# EAGLE design FFPTD (EAGLE 9.6.2)
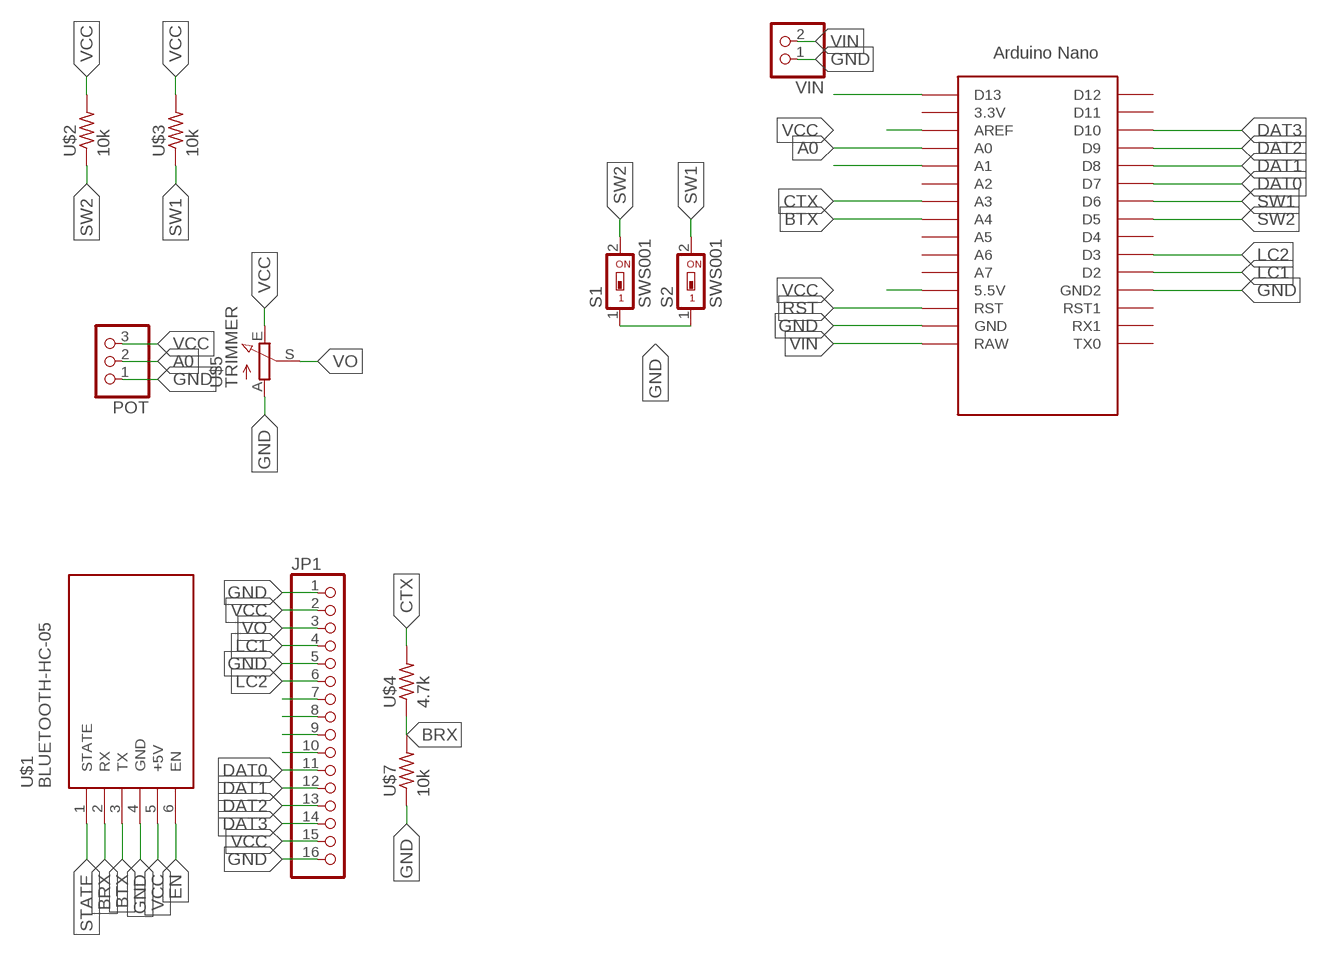
[diagram p0: schematic, sheet 1]

## Parts
JP1  PINHD-1X16  [1X16]
POT  PINHD-1X3  [1X03]
S1  SWS001  [SMS-001]
S2  SWS001  [SMS-001]
U$1  BLUETOOTH-HC-05  [WIRELESS-BLUETOOTH-HC-05]
U$2  10k  RES-7  [0204/7]
U$3  10k  RES-7  [0204/7]
U$4  4.7k  RES-7  [0204/7]
U$5  TRIMMER  [RJ9W]
U$6  ARDUINO_NANO  [NANO]
U$7  10k  RES-7  [0204/7]
VIN  PINHD-1X2  [1X02]

## Nets
A0: POT.2 U$6.A0
BRX: U$1.2(RX) U$4.1 U$7.2
BTX: U$1.3(TX) U$6.A4
CTX: U$4.2 U$6.A3
DAT0: JP1.11 U$6.D7
DAT1: JP1.12 U$6.D8
DAT2: JP1.13 U$6.D9
DAT3: JP1.14 U$6.D10
EN: U$1.6(EN)
GND: JP1.1 JP1.5 JP1.16 POT.1 S1.1 S2.1 U$1.4(GND) U$5.A U$6.GND U$6.GND1(GND2) U$7.1 VIN.1
LC1: JP1.4 U$6.D2
LC2: JP1.6 U$6.D3
N$31: U$6.A1
N$33: JP1.7
N$34: JP1.8
N$35: JP1.9
N$36: JP1.10
N$37: U$6.D13
RST: U$6.RST
STATE: U$1.1(STATE)
SW1: S2.2 U$3.1 U$6.D6
SW2: S1.2 U$2.1 U$6.D5
VCC: JP1.2 JP1.15 POT.3 U$1.5(+5V) U$2.2 U$3.2 U$5.E U$6.5V(5.5V) U$6.AREF
VIN: U$6.RAW VIN.2
VO: JP1.3 U$5.S
Unconnected: U$6.3.3V U$6.A2 U$6.A5 U$6.A6 U$6.A7 U$6.D4 U$6.D11 U$6.D12 U$6.RST1 U$6.RX1 U$6.TX0

## Library data of the parts
JP1 = pinhead:PINHD-1X16: PIN HEADER
POT = MIA_LIBRARY-2-2-2:PINHD-1X3: PIN HEADER
S1 S2 = smd-special:SWS001: SMD Dip Switch 1 pol.
U$1 = MIA_LIBRARY-2-2-2:BLUETOOTH-HC-05: Bluetooth Transceiver Module based on HC-05 board Tutorial is available here: https://arduino-info.wikispaces.com/BlueTooth-HC05-HC06-Modules-How-To Click here to find device on ebay.com <http://www.ebay.com/sch/hc-05+module+rs232>
U$2-U$4 U$7 = MIA_LIBRARY-2-2-2:RES-7
U$5 = MIA_LIBRARY-2-2-2:TRIMMER
U$6 = MIA_LIBRARY-2-2-2:ARDUINO_NANO: Arduino Nano
VIN = MIA_LIBRARY-2-2-2:PINHD-1X2: PIN HEADER

## Board
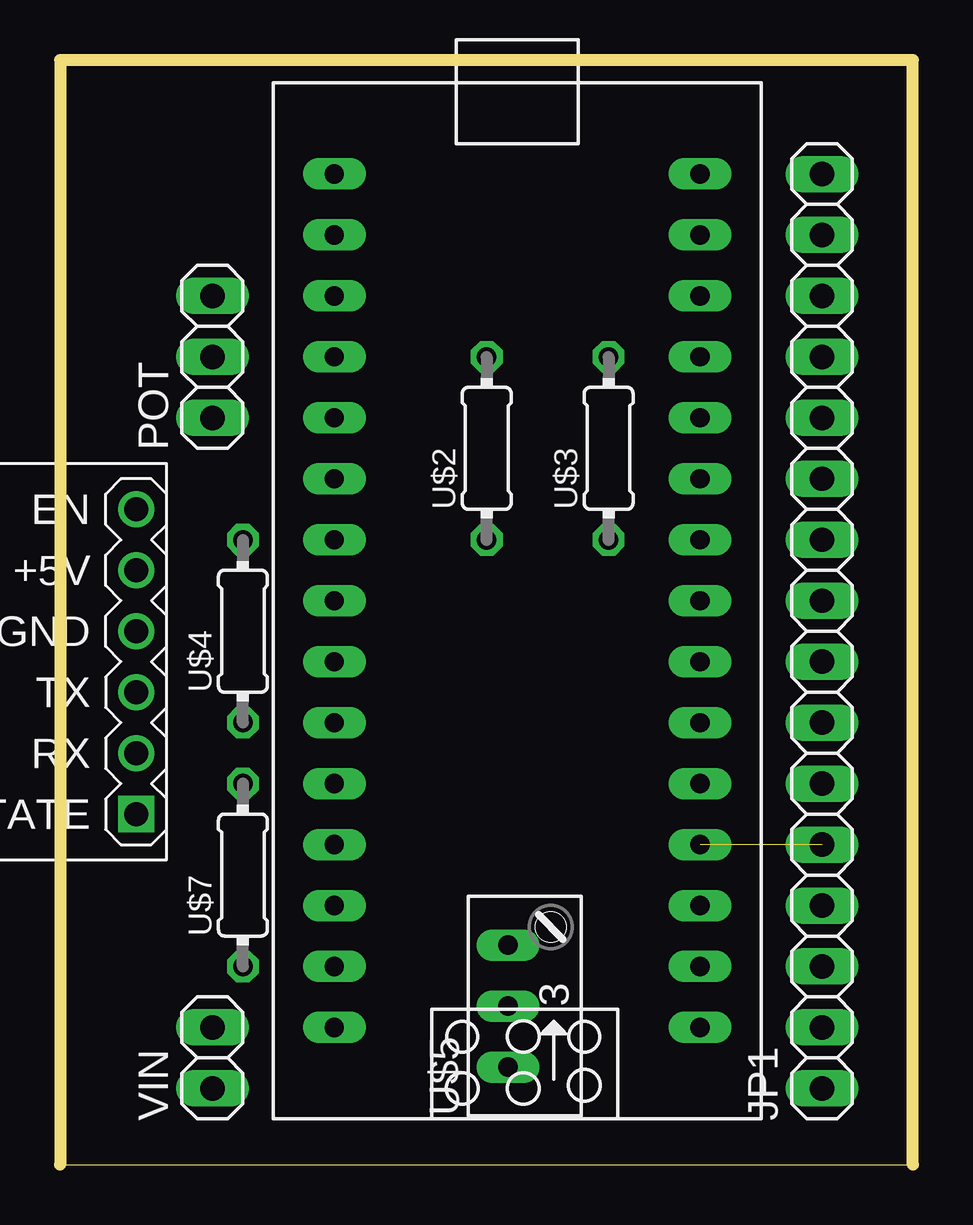
[diagram p1: board, top side]
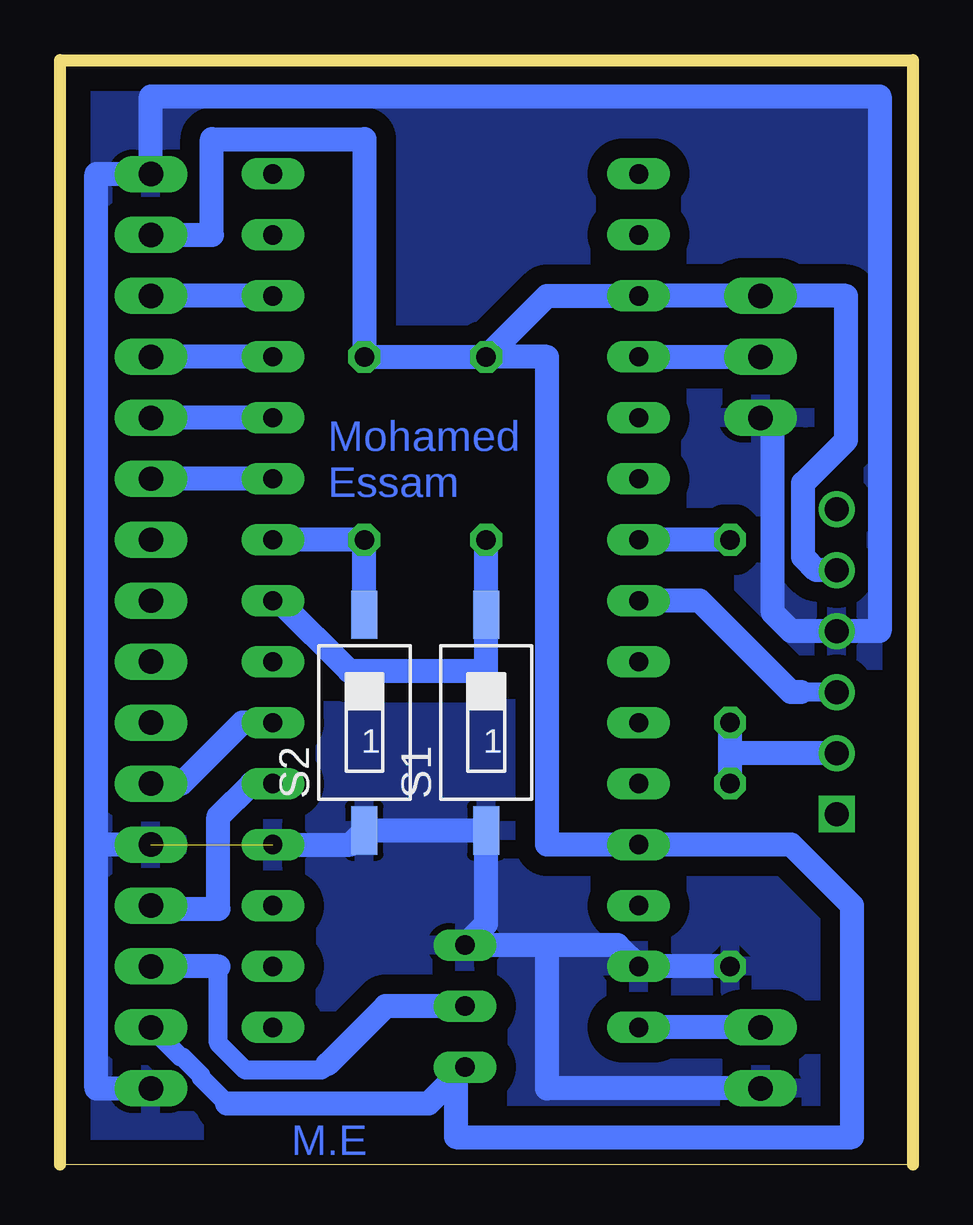
[diagram p2: board, bottom side, seen from below]

Size 35.54 x 46.02 mm. Coordinates in mm from the lower left corner, seen from the top.
Outline: 0,0 35.54,0 35.54,46.02 0,46.02 0,0
Copper layers (1*16): Top 0.035mm / dielectric 1.5mm / Bottom 0.035mm
Design rules "default": minimum track width 6mil, minimum drill 0.35mm, track to track 6mil, track to pad 6mil, pad to pad 6mil, via to via 6mil, smd to smd 6mil, copper to edge 40mil, drill to drill 6mil, minimum pad ring 10mil, minimum via ring 8mil, stop-mask expansion 4mil, vias tented up to drill 0mil, thermal gap 10mil

### Footprints (pad centres in the part's own frame; a part is rotated, then mirrored left to right if it is on the bottom)
1X16 = drill 1.016 long: 1 -19.05,0; 2 -16.51,0; 3 -13.97,0; 4 -11.43,0; 5 -8.89,0; 6 -6.35,0; 7 -3.81,0; 8 -1.27,0; 9 1.27,0; 10 3.81,0; 11 6.35,0; 12 8.89,0; 13 11.43,0; 14 13.97,0; 15 16.51,0; 16 19.05,0
1X03 = drill 1.016 long: 1 -2.54,0; 2 0,0; 3 2.54,0
SMS-001 = smd 1.092 x 2.007: 1 0,-4.496; 2 0,4.496
WIRELESS-BLUETOOTH-HC-05 = drill 1 square: 1 -6.35,-17.145 | drill 1: 2 -3.81,-17.145; 3 -1.27,-17.145; 4 1.27,-17.145; 5 3.81,-17.145; 6 6.35,-17.145
0204/7 = drill 0.813 octagon: 1 -3.81,0; 2 3.81,0
RJ9W = drill 0.813 long: A 2.54,0.635; E -2.54,0.635; S 0,0.635
NANO = drill 0.8 long: 3.3V -10.16,24.13; 5V -10.16,-1.27; A0 -10.16,19.05; A1 -10.16,16.51; A2 -10.16,13.97; A3 -10.16,11.43; A4 -10.16,8.89; A5 -10.16,6.35; A6 -10.16,3.81; A7 -10.16,1.27; AREF -10.16,21.59; D2 5.08,1.27; D3 5.08,3.81; D4 5.08,6.35; D5 5.08,8.89; D6 5.08,11.43; D7 5.08,13.97; D8 5.08,16.51; D9 5.08,19.05; D10 5.08,21.59; D11 5.08,24.13; D12 5.08,26.67; D13 -10.16,26.67; GND -10.16,-6.35; GND1 5.08,-1.27; RAW -10.16,-8.89; RST -10.16,-3.81; RST1 5.08,-3.81; RX1 5.08,-6.35; TX0 5.08,-8.89
1X02 = drill 1.016 long: 1 -1.27,0; 2 1.27,0

### Placement (x,y rotation side)
JP1  31.75,22.22 90 top
POT  6.35,33.66 90 top
S1  17.78,18.41 0 bottom
S2  22.86,18.41 0 bottom
U$1  -13.97,20.95 90 top
U$2  17.78,29.84 90 top
U$3  22.86,29.84 90 top
U$4  7.62,22.22 90 top
U$5  19.3,6.6 90 top
U$6  21.59,14.61 0 top
U$7  7.62,12.07 90 top
VIN  6.35,4.44 90 top

### Tracks (layer width: path | path; a pad name or v marks a point on that pad's centre or on a via)
A0
  Bottom 1: U$6.A0 POT.2
BRX
  Bottom 1: U$7.2 7.62,17.14 | 7.62,17.14 U$4.1 | U$1.2 7.62,17.14
BTX
  Bottom 0.8: U$1.3 4.66,19.68
  Bottom 1: 4.66,19.68 5.08,19.68 8.89,23.49 U$6.A4
CTX
  Bottom 1: U$4.2 U$6.A3
DAT0
  Bottom 1: U$6.D7 JP1.11
DAT1
  Bottom 1: U$6.D8 JP1.12
DAT2
  Bottom 1: U$6.D9 JP1.13
DAT3
  Bottom 1: U$6.D10 JP1.14
GND  (1 unrouted)
  Bottom 1: JP1.5 34.02,13.34 | 34.02,13.34 34.02,3.17 JP1.1 | VIN.1 15.24,3.17 15.24,9.14 | U$5.A 18.29,9.53 | U$6.GND1 23.44,13.34 S2.1 S1.1 17.78,10.03 U$5.A | 34.02,13.34 34.02,41.27 JP1.16 31.75,44.51 1.39,44.51 1.39,22.22 U$1.4 5.08,22.22 5.84,22.99 5.84,30.61 POT.1 | U$7.1 U$6.GND 12.32,9.14 15.24,9.14 | 15.24,9.14 U$5.A
  pour Bottom (isolate 0.813): -5.08,52.7 40.64,52.7 40.64,-4.45 -6.35,-4.45 -6.35,51.44
LC1
  Bottom 1: JP1.4 31.61,10.65 28.94,10.65 28.94,14.49 27.56,15.88 U$6.D2
LC2
  Bottom 1: U$6.D3 27.94,18.41 30.48,15.88 JP1.6
SW1
  Bottom 1: S2.2 U$3.1 U$6.D6
SW2
  Bottom 1: U$2.1 S1.2 17.78,20.57 23.5,20.57 26.42,23.49 U$6.D5
VCC
  Bottom 0.8: 28.57,2.54 29.67,3.64 29.67,3.72 30.44,4.49 30.52,4.49 JP1.2
  Bottom 1: 28.57,2.54 20.19,2.54 U$5.E 19.05,3.68 19.05,1.14 2.54,1.14 2.54,10.79 5.08,13.34 U$6.5V 15.24,13.34 15.24,33.66 U$2.2 | JP1.15 29.21,38.73 29.21,42.73 22.86,42.73 U$3.2 U$2.2 | U$2.2 15.24,36.2 U$6.AREF POT.3 2.79,36.2 2.79,30.19 4.58,28.4 4.58,25.32 4.02,24.77 U$1.5
VIN
  Bottom 1: VIN.2 U$6.RAW
VO
  Bottom 0.8: 24.38,4.19 24.64,3.94 27.81,3.94 28.94,5.06 28.94,8.26
  Bottom 1: 28.94,8.26 JP1.3 | U$5.S 21.97,6.6 24.38,4.19

### Text on the board
Bottom: Mohamed / Essam | M.E